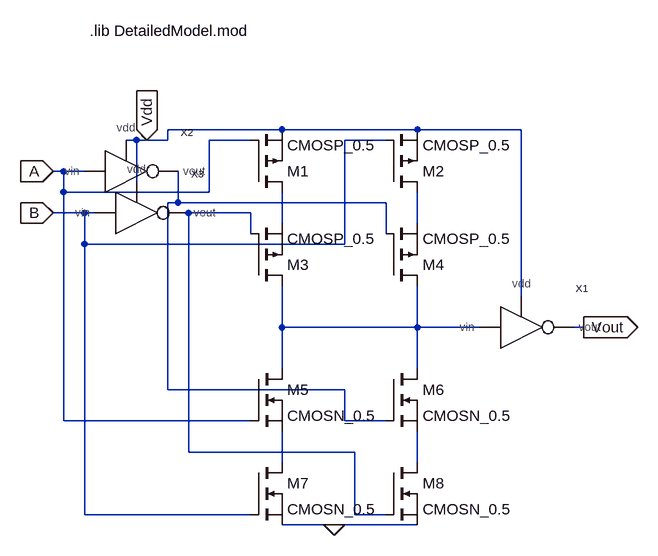
[diagram p0: schematic s_xnor.asc]
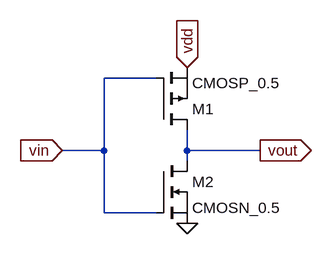
[diagram p1: sub-circuit s_inv.asc]
s_xnor.asc, the LTspice schematic file:
Version 4
SHEET 1 880 680
WIRE 288 -32 112 -32
WIRE 496 -32 288 -32
WIRE 656 -32 496 -32
WIRE 64 -16 48 -16
WIRE 80 -16 64 -16
WIRE 112 -16 112 -32
WIRE 112 -16 80 -16
WIRE 240 -16 176 -16
WIRE 448 -16 384 -16
WIRE -48 32 -64 32
WIRE -16 32 -48 32
WIRE 64 48 64 -16
WIRE -48 64 -48 32
WIRE 176 64 176 -16
WIRE 176 64 -48 64
WIRE 128 80 128 32
WIRE 128 80 112 80
WIRE 448 80 128 80
WIRE -16 96 -64 96
WIRE 0 96 -16 96
WIRE 240 96 144 96
WIRE 288 112 288 64
WIRE 496 112 496 64
WIRE 240 128 240 96
WIRE 448 128 448 80
WIRE -16 144 -16 96
WIRE 384 144 384 -16
WIRE 384 144 -16 144
WIRE 656 224 656 -32
WIRE 288 272 288 208
WIRE 496 272 496 208
WIRE 496 272 288 272
WIRE 592 272 496 272
WIRE 752 272 736 272
WIRE 288 336 288 272
WIRE 496 336 496 272
WIRE 112 368 112 80
WIRE 384 368 112 368
WIRE -48 416 -48 64
WIRE 240 416 -48 416
WIRE 384 416 384 368
WIRE 448 416 384 416
WIRE 144 464 144 96
WIRE 400 464 144 464
WIRE 288 480 288 432
WIRE 496 480 496 432
WIRE -16 560 -16 144
WIRE 240 560 -16 560
WIRE 400 560 400 464
WIRE 448 560 400 560
WIRE 368 576 288 576
WIRE 496 576 368 576
FLAG 80 -16 Vdd
IOPIN 80 -16 In
FLAG -64 32 A
IOPIN -64 32 In
FLAG -64 96 B
IOPIN -64 96 In
FLAG 368 576 0
FLAG 752 272 Vout
IOPIN 752 272 Out
SYMBOL pmos 240 64 M180
SYMATTR InstName M1
SYMATTR Value CMOSP_0.5
SYMBOL pmos 448 64 M180
SYMATTR InstName M2
SYMATTR Value CMOSP_0.5
SYMBOL pmos 240 208 M180
SYMATTR InstName M3
SYMATTR Value CMOSP_0.5
SYMBOL pmos 448 208 M180
SYMATTR InstName M4
SYMATTR Value CMOSP_0.5
SYMBOL nmos 240 336 R0
SYMATTR InstName M5
SYMATTR Value CMOSN_0.5
SYMBOL nmos 448 336 R0
SYMATTR InstName M6
SYMATTR Value CMOSN_0.5
SYMBOL nmos 240 480 R0
SYMATTR InstName M7
SYMATTR Value CMOSN_0.5
SYMBOL nmos 448 480 R0
SYMATTR InstName M8
SYMATTR Value CMOSN_0.5
SYMBOL s_inv 656 272 R0
SYMATTR InstName X1
SYMBOL s_inv 48 32 R0
SYMATTR InstName X2
SYMBOL s_inv 64 96 R0
SYMATTR InstName X3
TEXT -8 -184 Left 2 !.lib DetailedModel.mod

s_inv.asc, the sub-circuit schematic file:
Version 4
SHEET 1 880 680
WIRE 128 -112 48 -112
WIRE 48 0 48 -112
WIRE 48 0 -16 0
WIRE 176 0 176 -32
WIRE 288 0 176 0
WIRE 176 16 176 0
WIRE 48 96 48 0
WIRE 128 96 48 96
FLAG 288 0 vout
IOPIN 288 0 Out
FLAG -16 0 vin
IOPIN -16 0 In
FLAG 176 -128 vdd
IOPIN 176 -128 In
FLAG 176 112 0
SYMBOL pmos 128 -32 M180
SYMATTR InstName M1
SYMATTR Value CMOSP_0.5
SYMBOL nmos 128 16 R0
SYMATTR InstName M2
SYMATTR Value CMOSN_0.5

The netlist it stands for:
* s_xnor.asc
M1 N003 A Vdd Vdd CMOSP_0.5
M2 N004 B Vdd Vdd CMOSP_0.5
M3 N005 N002 N003 N003 CMOSP_0.5
M4 N005 N001 N004 N004 CMOSP_0.5
M5 N005 A N006 N006 CMOSN_0.5
M6 N005 N001 N007 N007 CMOSN_0.5
M7 N006 B 0 0 CMOSN_0.5
M8 N007 N002 0 0 CMOSN_0.5
XX1 N005 Vout Vdd s_inv
XX2 A N001 Vdd s_inv
XX3 B N002 Vdd s_inv

* block symbol definitions
.subckt s_inv vin vout vdd
M1 vout vin vdd vdd CMOSP_0.5
M2 vout vin 0 0 CMOSN_0.5
.ends s_inv

.model NMOS NMOS
.model PMOS PMOS
.lib standard.mos
.lib DetailedModel.mod
.backanno
.end